# Altium schematic sheet 03_POWER.SchDoc: =TitleParameter
size A3; Organization: ASISGUARD; Address1: Kemalpasa, Kemalpasa Cd. No:290 D:292H, 35060 Bornova/Izmir/Turkey; SheetNumber: 3; SheetTotal: 6
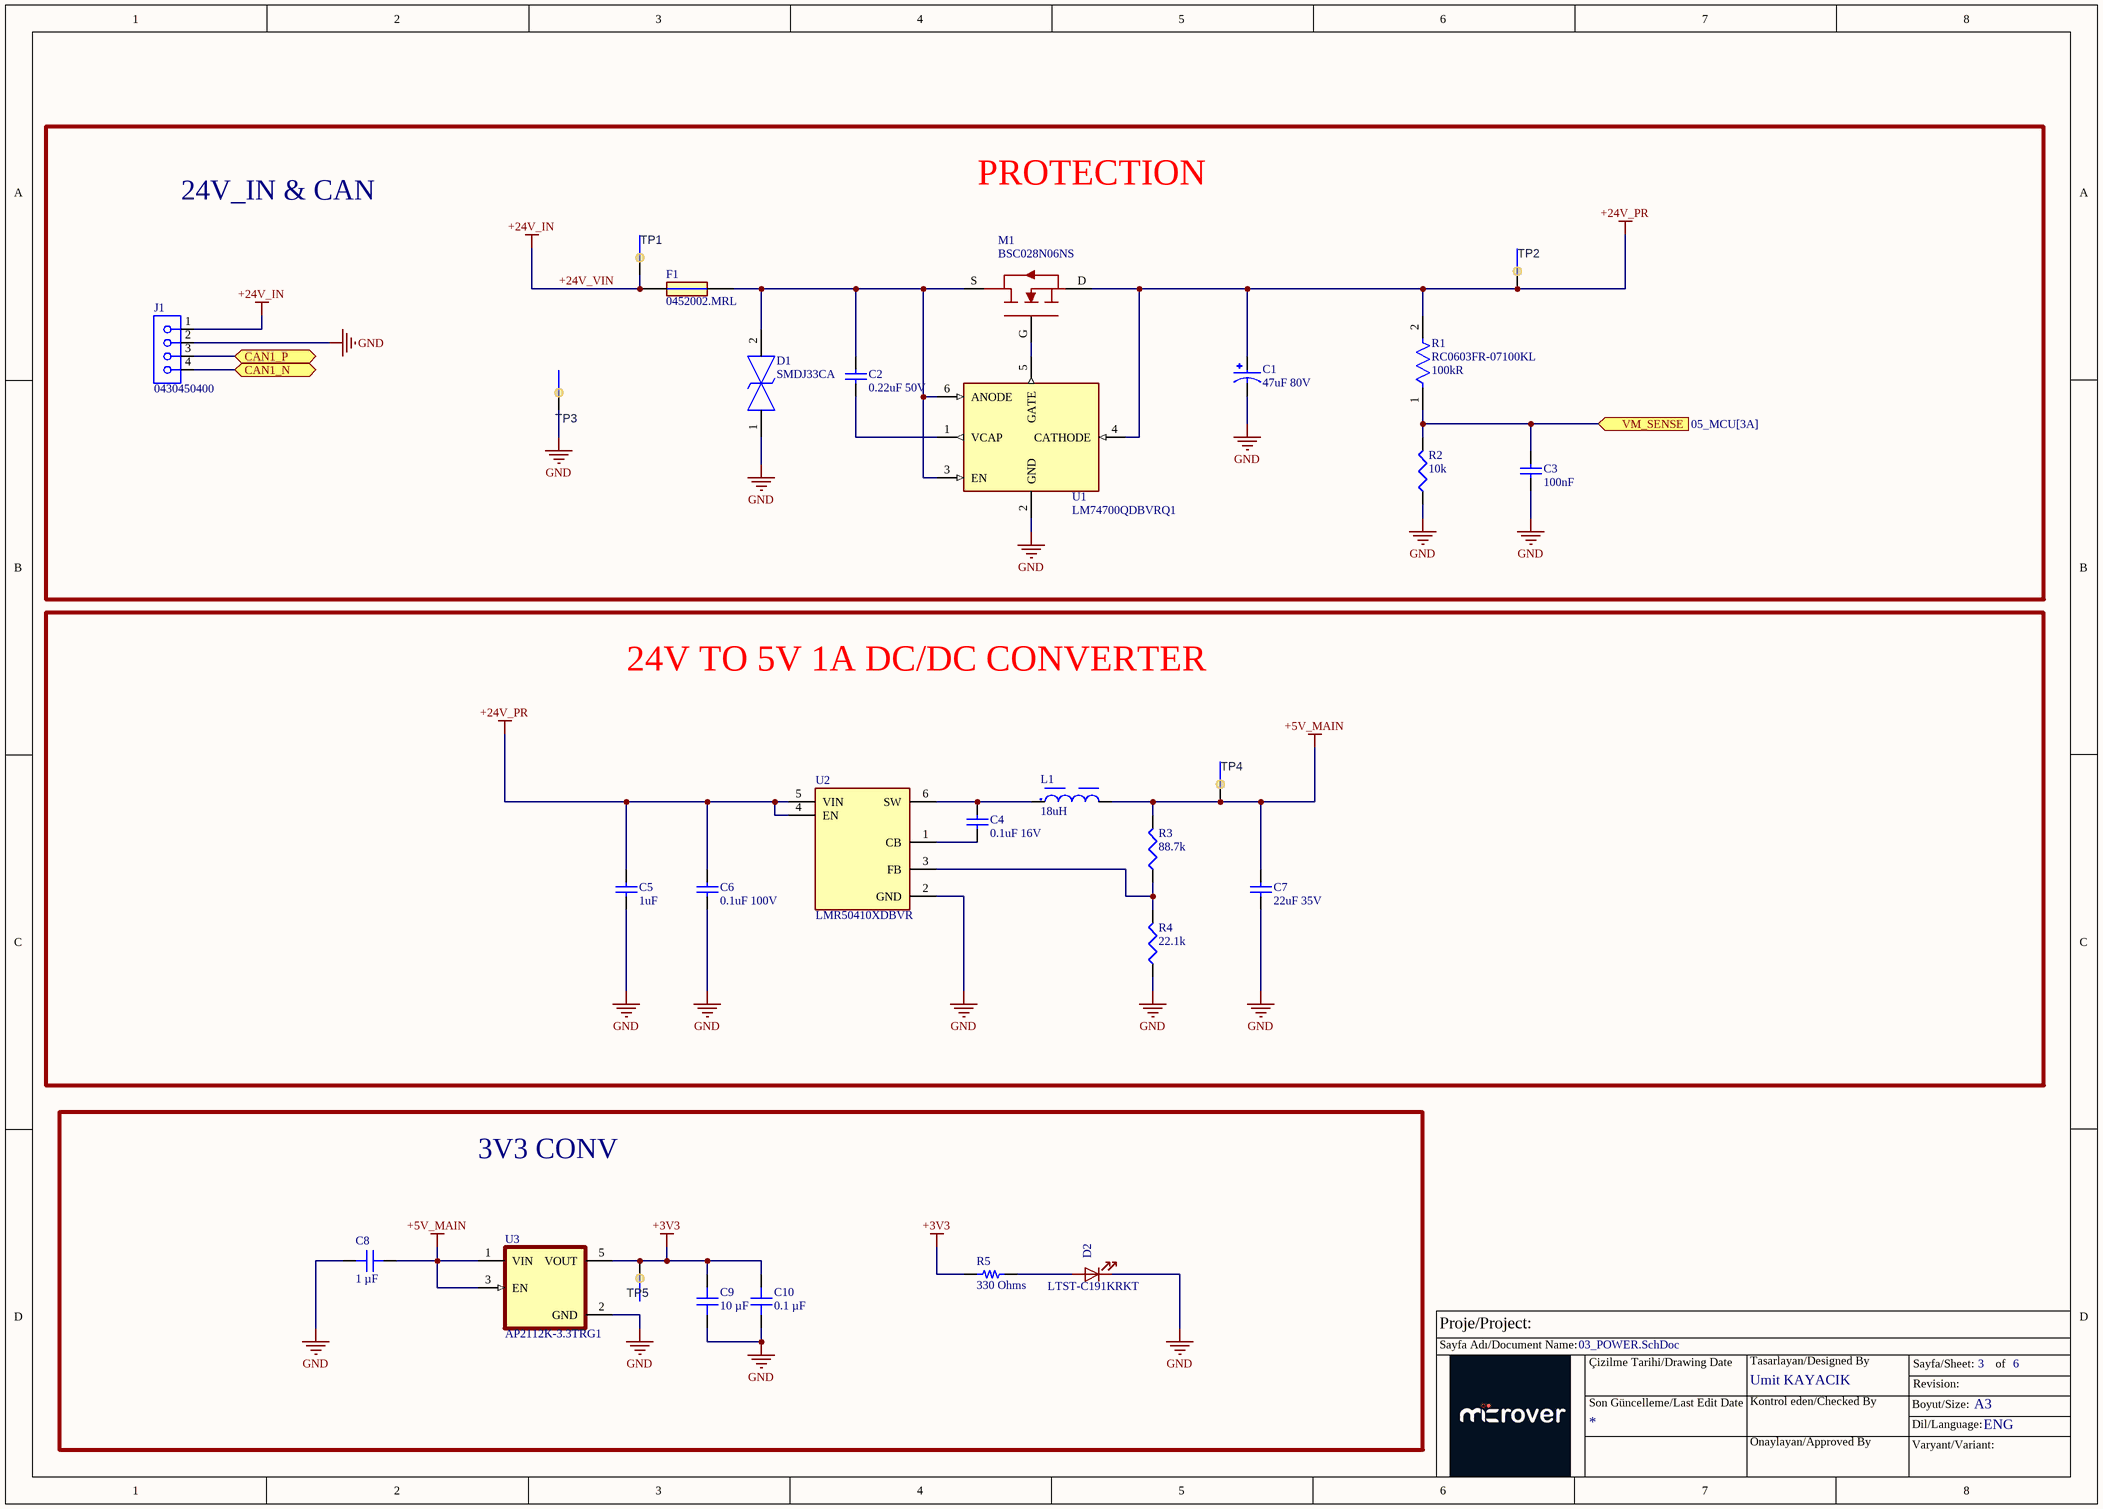
[diagram p0: 03_POWER.SchDoc]

## Parts
C1  47uF 80V  [CAP_EEEFK1K470P]
C2  value 0.22uF 50V  [SMC0603]  (hidden comment: CAP CER 0.22UF 50V X7R 0603)
C3  value 100nF  [CAP0603]  (hidden comment: 100nF 25V)
C4  0.1uF 16V  [CAP0603]
C5  1uF  [CAP0603]
C6  0.1uF 100V  [CAP0603]
C7  22uF 35V  [CAP1206]
C8  1 µF  [CAP 0603_1608]
C9  10 µF  [CAP 0805_2012]
C10  Capacitance: 0.1 µF  [CAP 0603_1608]  (hidden comment: GCM188R71H104KA57J)
D1  SMDJ33CA  [DIONM7959X262N]
D2  LTST-C191KRKT  [LED0603]
F1  0452002.MRL  [FUSC6127X294N]
J1  0430450400  [CONN_SD-43045-001_04_MOL]
L1  18uH  [WE-LQS_6045]
M1  BSC028N06NS  [BSC028N06NS]
R1  RC0603FR-07100KL  Resistance: 100kR  [FP-RC0603-0_55-MFG]
R2  value 10k  [RES0603]  (hidden comment: RES 10K OHM 1% 1/8W 0603)
R3  88.7k  [RES0603]
R4  22.1k  [RES0603]
R5  330 Ohms  [RES 0603_1608]
TP1  Testpoint  [SMD_1P5mm]  (value not drawn)  (no BOM)
TP2  Testpoint  [SMD_1P5mm]  (value not drawn)  (no BOM)
TP3  Testpoint  [SMD_1P5mm]  (value not drawn)  (no BOM)
TP4  Testpoint  [SMD_1P5mm]  (value not drawn)  (no BOM)
TP5  Testpoint  [SMD_1P5mm]  (value not drawn)  (no BOM)
U1  LM74700QDBVRQ1  [SOT95P280X145-6N/LM74700QDBVRQ1]
U2  LMR50410XDBVR  [SOT95P280X145-6N/]
U3  AP2112K-3.3TRG1  [SOT95P285X140-5N]

## Blocks framed on the sheet
PROTECTION: C1-C3 D1 F1 J1 M1 R1 R2 TP1-TP3 U1
24V TO 5V 1A DC/DC CONVERTER: C4-C7 L1 R3 R4 TP4 U2
3V3 CONV: C8-C10 D2 R5 TP5 U3

## Ports
CAN1_N (bidir, see 04_CAN[8B]), CAN1_P (bidir, see 04_CAN[8B]), VM_SENSE (in, see 05_MCU[3A])

## Nets
+3V3: C9.2 C10.2 R5.1 TP5.1(TP) U3.5(VOUT)
+5V_MAIN: C7.2 C8.2 L1.2 R3.2 TP4.1(TP) U3.1(VIN) U3.3(EN)
+24V_PR: C1.1 C5.2 C6.2 M1.D R1.2 TP2.1(TP) U1.4(CATHODE) U2.4(EN) U2.5(VIN)
+24V_VIN: F1.1 J1.1 TP1.1(TP)  [also labelled +24V_IN]
GND: C1.2 C3.1 C5.1 C6.1 C7.1 C8.1 C9.1 C10.1 D1.1 D2.2(K) J1.2 R2.1 R4.1 TP3.1(TP) U1.2(GND) U2.2(GND) U3.2(GND)
CAN1_N: J1.4 ; port CAN1_N
CAN1_P: J1.3 ; port CAN1_P
VM_SENSE: C3.2 R1.1 R2.2 ; port VM_SENSE
NetC2_1: C2.1 U1.1(VCAP)
NetC2_2: C2.2 D1.2 F1.2 M1.S U1.3(EN) U1.6(ANODE)
NetC4_1: C4.1 U2.1(CB)
NetC4_2: C4.2 L1.1 U2.6(SW)
NetD2_1: D2.1(A) R5.2
NetM1_G: M1.G U1.5(GATE)
NetR3_1: R3.1 R4.2 U2.3(FB)

## Notes on the sheet
- 24V_IN & CAN
- Proje/Project:
- Sayfa Adı/Document Name:
- Çizilme Tarihi/Drawing Date
- Umit KAYACIK
- Tasarlayan/Designed By
- Sayfa/Sheet:
- Revision:
- of
- Son Güncelleme/Last Edit Date
- Kontrol eden/Checked By
- Onaylayan/Approved By
- Boyut/Size:
- Varyant/Variant:
- Dil/Language:
- A3
- ENG

## Library data of the parts
C1 = EEE-FK1K470P: 47 µF 80 V Aluminum Electrolytic Capacitors Radial, Can - SMD 2000 Hrs @ 105°C; Manufacturer: Panasonic Industry; Supplier: Digi; PCE3831DKR-ND
C2 = CAP0603_0.22UF_50V: 0.22 µF ±10% 50V Ceramic Capacitor X7R 0603 (1608 Metric); Manufacturer Part Number: GCM188R71H224KA64D; Order Code: DIGI: 490-5402-2-ND
C3 = CAP0603_100nF: 0.1 µF ±10% 50V Ceramic Capacitor X7R 0603 (1608 Metric); Manufacturer Part Number: CL10B104KA8NNNC; LCSC Part Number: C1590
C4 = C0603C104M4RACTU: 0.1 µF ±20% 16V Ceramic Capacitor X7R 0603 (1608 Metric); Manifacturer: KEMET; Supplier: Digi; 399-C0603C104M4RACTUDKR-ND
C5 = MSASU168SB5105MTNA01: CAP CER 1UF 50V X5R 0603; Manufacturer: Taiyo Yuden; Supplier: 587-MSASU168SB5105MTNA01DKR-ND
C6 = GRM188R72A104KA35D: CAP CER 0.1UF 100V X7R 0603; Manifacturer: Murata Electronics; Supplier: Digi; 490-3285-6-ND
C7 = CAP1206_22uF_35V: 22 µF ±20% 35V Ceramic Capacitor X5R 1206 (3216 Metric); Manufacturer Part Number: C3216X5R1V226M160AC; Order Code: DIGI : 445-180362-1-ND; Value: 22uF 35V
C8 = GMC10X7R105K25NT: CAP0603 X7R 1UF 10% 25V; manufacturer: Cal-Chip Electronics, Inc.; Part Number: GMC10X7R105K25NT; Capacitance: 1 µF; Applications: General Purpose; componentlink1description: Datasheet; componentlink1url: https://calchip.com/wp-content/uploads/2023/05/gmc_series.pdf; componentlink2description: DigiKey Link; componentlink2url: https://www.digikey.com/en/products/detail/cal-chip-electronics-inc/GMC10X7R105K25NT/22461338; Device Package: 0603 (1608 Metric); lastupdated: 4/6/2026 7:18:33 PM; Lifecycle Status: Active; Minimum Order: 1; Mounting Type: Surface Mount, MLCC; Operating Temperature: -55°C ~ 125°C; Package / Case: 0603 (1608 Metric); packaging: TapeAndReel; partid: 68086; price: 0.01; series: GMC; Size / Dimension: 0.063" L x 0.031" W (1.60mm x 0.80mm); Supplier 1: DigiKey; Supplier Part Number 1: 4713-GMC10X7R105K25NTCT-ND; Temperature Coefficient: X7R; Thickness (Max): 0.037" (0.95mm); Tolerance: ±10%; value: 1 µF; Voltage - Rated: 25V
C9 = GRM21BR61H106KE43L: CAP CER 10UF 50V X5R 0805; manufacturer: Murata Electronics; Tolerance: ±10%; Part Number: GRM21BR61H106KE43L; Capacitance: 10 µF; Applications: Mobile Devices Only; componentlink1description: Datasheet; componentlink1url: https://search.murata.co.jp/Ceramy/image/img/A01X/G101/ENG/GRM21BR61H106KE43-01A.pdf; componentlink2description: DigiKey Link; componentlink2url: https://www.digikey.com/en/products/detail/murata-electronics/GRM21BR61H106KE43L/10326316; Device Package: 0805 (2012 Metric); lastupdated: 4/6/2026 7:32:58 PM; Lifecycle Status: Active; Minimum Order: 1; Mounting Type: Surface Mount, MLCC; Operating Temperature: -55°C ~ 85°C; Package / Case: 0805 (2012 Metric); packaging: TapeAndReel; partid: 39284; Part Status: Active; price: 0.04; series: GRM; Size / Dimension: 0.079" L x 0.049" W (2.00mm x 1.25mm); Supplier 1: DigiKey; Supplier Part Number 1: 490-18663-1-ND; Temperature Coefficient: X5R; Thickness (Max): 0.057" (1.45mm); value: 10 µF; Voltage - Rated: 50V
C10 = GCM188R71H104KA57J: CAP CER 0.1UF 50V X7R 0603; manufacturer: Murata Electronics; Tolerance: ±10%; Part Number: GCM188R71H104KA57J; Applications: Automotive; componentlink1description: Datasheet; componentlink1url: https://psearch.en.murata.com/capacitor/product/GCM188R71H104KA57%23.pdf; componentlink2description: DigiKey Link; componentlink2url: https://www.digikey.com/en/products/detail/murata-electronics/GCM188R71H104KA57J/2591942; Device Package: 0603 (1608 Metric); lastupdated: 4/6/2026 7:22:36 PM; Lifecycle Status: Active; Minimum Order: 1; Mounting Type: Surface Mount, MLCC; Operating Temperature: -55°C ~ 125°C; Package / Case: 0603 (1608 Metric); packaging: TapeAndReel; partid: 60442; Part Status: Not For New Designs; price: 0.03; Ratings: AEC-Q200; series: GCM; Size / Dimension: 0.063" L x 0.031" W (1.60mm x 0.80mm); Supplier 1: DigiKey; Supplier Part Number 1: 490-8020-1-ND; Temperature Coefficient: X7R; Thickness (Max): 0.035" (0.90mm); Voltage - Rated: 50V
D1 = SMDJ33CA: 53.3V Clamp 56.3A Ipp Tvs Diode Surface Mount DO-214AB (SMCJ); Manufacturer: Littelfuse Inc.; Supplier: Digi; SMDJ33CADKR-ND
D2 = LED_1: LED RED CLEAR SMD; Manufacturer: Lite-On Inc.; Value: LTST-C191KRKT; Footprint: LED_SMD:LED_0603_1608Metric; Manufacturer Part Number: LTST-C191KRKT; Supplier Part Number: 160-1447-1-ND
F1 = 0452002.MRL: 2 A 125 V 125 V Fuse Board Mount (Cartridge Style Excluded) Surface Mount 2-SMD, Square End Block; Manufacturer: Littelfuse Inc.; Supplier: Digi; F2602DKR-ND
J1 = 0430450400: Connector Header Through Hole, Right Angle 4 position 0.118" (3.00mm); Manifacturer: MOLEX; Supplier: Digi; WM1814-ND
L1 = 74404064180: 18 µH Semi-Shielded Drum Core, Wirewound Inductor 2.2 A 81mOhm Nonstandard; Supplier: 732-5553-6-ND
M1 = BSC028N06NS: MOSFET'ler N-Ch 60V 100A TDSON-8 OptiMOS 3
R1 = CMP-2100-03662-2: RES SMD 100K OHM 1% 1/10W 0603; Voltage Rating (DC): 50V; Max Power Dissipation: 100mW; Temperature Coefficient: 100ppm/°C; Working Voltage: 75V; Length: 1.6mm; Lead Free: Lead Free; Number of Terminations: 2; Packaging: Tape and Reel; Voltage Rating: 50V; Termination: SMD/SMT; Width: 0.8mm; Resistor Type: Thick Film; Resistance Tolerance: 1%; Features: Moisture Resistant; Height: 0.45mm; Construction: Rectangular; Case/Package: 0603; Military Standard: Not; Case Code (Imperial): 0603; Series: RC; Technology: THICK FILM; Depth: 0.8mm; RoHS Compliant: Yes; REACH SVHC: No SVHC; Min Operating Temperature: -55°C; Case Code (Metric): 1608; Max Operating Temperature: 155°C; Power Rating: 100mW; Number of Pins: 2; Tolerance: 1%
R2 = RES0603_10K_%1_1: 10 kOhms ±1% 0.125W, 1/8W Chip Resistor 0603 (1608 Metric) Anti-Sulfur Thin Film; Manufacturer Part Number: RNCP0603FTD10K0; LCSC Manufacturer Part Number: MCT06030C1002FP500; Order Code: Digi: RNCP0603FTD10K0TR-ND; Sirius Stock Code: *; LCSC Part Number: C161803
R3 = CRCW060388K7FKEA: 88.7 kOhms ±1% 0.125W, 1/8W Chip Resistor 0603 (1608 Metric) Automotive AEC-Q200 Thick Film
R4 = RC0603FR-0722K1L: 22.1 kOhms ±1% 0.1W, 1/10W Chip Resistor 0603 (1608 Metric) Moisture Resistant Thick Film
R5 = CRGH0603F330R: RES SMD 330 OHM 1% 1/5W 0603; Manufacturer: TE Connectivity Passive Product; Power (Watts): 0.2W, 1/5W; Temperature Coefficient: ±100ppm/°C; Part Number: CRGH0603F330R; Value: 330 Ohms; ComponentLink1Description: Datasheet; ComponentLink1URL: https://www.te.com/commerce/DocumentDelivery/DDEController?Action=srchrtrv&DocNm=1773204-1&DocType=DS&DocLang=English; ComponentLink2Description: DigiKey Link; ComponentLink2URL: https://www.digikey.com/en/products/detail/te-connectivity-passive-product/CRGH0603F330R/5586961; Composition: Thick Film; Device Package: 0603 (1608 Metric); Height - Seated (Max): 0.022" (0.55mm); LastUpdated: 2/9/2024 8:43:33 PM; Lifecycle Status: Active; Minimum Order: 1; Number of Terminations: 2; Operating Temperature: -55°C ~ 155°C; Package / Case: 0603 (1608 Metric); Packaging: TapeAndReel; PartId: 5733; Part Status: Active; Price: 0.01; Resistance: 330 Ohms; Series: CRGH, Neohm; Size / Dimension: 0.063" L x 0.031" W (1.60mm x 0.80mm); Supplier 1: DigiKey; Supplier Part Number 1: A129541CT-ND; Supplier Device Package: 0603; Tolerance: ±1%
TP1-TP5 = Testpoint / 1.0mm Pad / TP100: Testpoint / 2.0mm Pad / TP200; Value: Testpoint; DNP: DNP
U1 = LM74700QDBVRQ1: OR Controller N+1 ORing Controller N-Channel 1:1 SOT-23-6
U2 = LMR50410XDBVR: Buck Switching Regulator IC Positive Adjustable 1V 1 Output 1A SOT-23-6; Supplier: 296-LMR50410XDBVRDKR-ND; MPN: LMR50410XDBVR
U3 = AP2112K-3.3TRG1: Linear Voltage Regulator IC Positive Fixed 1 Output 600mA SOT-25; MF: Diodes Inc.; Value: *; Purchase-URL: https://pricing.snapeda.com/search/part/AP2112K-3.3TRG1/?ref=eda; Package: SOT-753 Diodes Inc.; Availability: In Stock; Check_prices: https://www.snapeda.com/parts/AP2112K-3.3TRG1/Diodes+Inc./view-part/?ref=eda; Price: None; SnapEDA_Link: https://www.snapeda.com/parts/AP2112K-3.3TRG1/Diodes+Inc./view-part/?ref=snap; MP: AP2112K-3.3TRG1